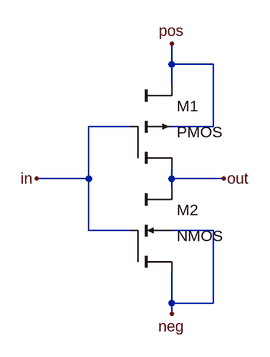
[diagram p0: schematic Inverter.asc]
Inverter.asc, the LTspice schematic file:
Version 4
SHEET 1 880 680
WIRE 176 -48 176 -80
WIRE 240 -48 176 -48
WIRE 176 -16 176 -48
WIRE 112 48 48 48
WIRE 240 48 240 -48
WIRE 240 48 176 48
WIRE 48 128 48 48
WIRE 48 128 -32 128
WIRE 176 128 176 112
WIRE 256 128 176 128
WIRE 176 144 176 128
WIRE 48 208 48 128
WIRE 112 208 48 208
WIRE 240 208 176 208
WIRE 176 320 176 272
WIRE 240 320 240 208
WIRE 240 320 176 320
WIRE 176 336 176 320
FLAG -32 128 in
FLAG 256 128 out
FLAG 176 -80 pos
FLAG 176 336 neg
SYMBOL cktsym\\pmos4 176 48 R0
SYMATTR InstName M1
SYMATTR SpiceModel ""
SYMATTR Value2 l=.6u w=4.2u
SYMATTR SpiceLine ""
SYMATTR SpiceLine2 ""
SYMBOL cktsym\\nmos4 176 208 R0
SYMATTR InstName M2
SYMATTR SpiceModel ""
SYMATTR Value2 l=.6u w=3u
SYMATTR SpiceLine ""
SYMATTR SpiceLine2 ""

The netlist it stands for:
* Inverter.asc
M1 out in pos pos PMOS l=.6u w=4.2u
M2 out in neg neg NMOS l=.6u w=3u
.model NMOS NMOS
.model PMOS PMOS
.lib standard.mos
.backanno
.end